# Altium schematic sheet boot.SCHDOC: Soma Backplane Front Panel PCB
size B; Engineer: Eric Jonas (jonas@soma.mit.edu); Organization: Wilson Lab; Address1: Picower Institute, MIT; Address2: 43 Vassar St. 46-5227; Address3: Cambridge, MA 02139; Address4: Australia 2086
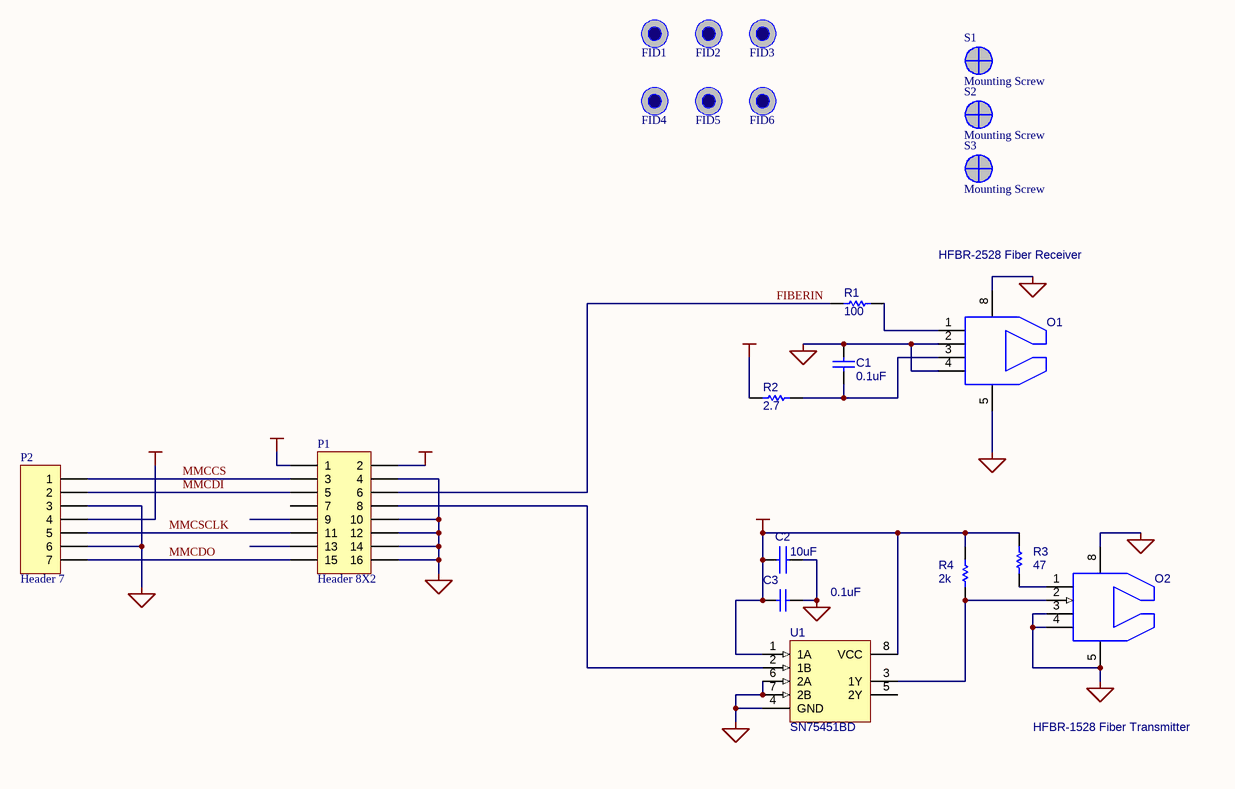
[diagram p0: boot.SCHDOC]

## Parts
C1  value 0.1uF  [CC1608-0603]  (hidden comment: Cap)
C2  value 10uF  [0603]  (hidden comment: CAPACITOR)
C3  value 0.1uF  [CC1608-0603]  (hidden comment: Cap)
FID1  FIDUCIAL  [FIDUCIAL]  (value not drawn)
FID2  FIDUCIAL  [FIDUCIAL]  (value not drawn)
FID3  FIDUCIAL  [FIDUCIAL]  (value not drawn)
FID4  FIDUCIAL  [FIDUCIAL]  (value not drawn)
FID5  FIDUCIAL  [FIDUCIAL]  (value not drawn)
FID6  FIDUCIAL  [FIDUCIAL]  (value not drawn)
O1  HFBR-2528 Fiber Receiver  [HPVL]
O2  HFBR-1528 Fiber Transmitter  [HPVL]
P1  Header 8X2  [MOLEX 15-91-2160]
P2  Header 7  [SCDA1A1501]
R1  value 100  [CR1608-0603]  (hidden comment: Res1)
R2  value 2.7  [CR1608-0603]  (hidden comment: Res1)
R3  value 47  [CR1608-0603]  (hidden comment: Res1)
R4  value 2k  [CR1608-0603]  (hidden comment: Res1)
S1  Mounting Screw  [SCREW6-32]
S2  Mounting Screw  [SCREW6-32]
S3  Mounting Screw  [SCREW6-32]
U1  SN75451BD  [SO-G8/E2.5]

## Nets
+5VCC: C2.1 C3.1 P1.2 R2.1 R3.2 R4.2 U1.1(1A) U1.8(VCC)
GND: C1.2 C2.2 C3.2 O1.2 O1.4 O1.5 O1.8 O2.3 O2.4 O2.5 O2.8 P1.4 P1.10 P1.12 P1.14 P1.16 P2.3 P2.6 U1.4(GND) U1.6(2A) U1.7(2B)
VCC: P1.1 P2.4
FIBERIN: P1.6 R1.1
MMCCS: P1.3 P2.1
MMCDI: P1.5 P2.2
MMCDO: P1.15 P2.7
MMCSCLK: P1.11 P2.5
NetC1_1: C1.1 O1.3 R2.2
NetO1_1: O1.1 R1.2
NetO2_1: O2.1 R3.1
NetO2_2: O2.2 R4.1 U1.3(1Y)
NetP1_8: P1.8 U1.2(1B)

Not connected (* = marked no-connect by the designer): P1 7 9 13; U1 5(2Y)

## Notes on the sheet
- Title:
- Engineer:
- Date:
- Revision:
- Sheet
- of
- File:

## Library data of the parts
C1 C3 = Cap: Capacitor; Manufacturer: Generic Components; Class I: Passive; Published: 8-Jun-2000; Revision: July-2002: Re-released for DXP Platform.; Publisher: Altium Limited; Class II: Capacitor
C2 = CAPACITOR: Standard Capacitor
O1 = HFBR-2528: Low-cost fiber receiver; Vendor: Agilent
O2 = HFBR-1528: Low-cost fiber transmitter; Vendor: Agilent
P1 = Header 8X2: Header, 8-Pin, Dual row; LatestRevisionDate: 17-Jul-2002; LatestRevisionNote: Re-released for DXP Platform.; Publisher: Altium Limited
P2 = Header 7: Header, 7-Pin; LatestRevisionDate: 17-Jul-2002; LatestRevisionNote: Re-released for DXP Platform.; Publisher: Altium Limited
R1-R4 = Res1: Resistor; Manufacturer: Generic Components; Class I: Passive; Published: 8-Jun-2000; Revision: July-2002: Re-released for DXP Platform.; Publisher: Altium Limited; Class II: Resistor
S1-S3 = MNTSCREW
U1 = SN75451BD: Dual Peripheral Driver; Manufacturer: Texas Instruments; Package Information: Latest Revision: Jan-1998; Class I: Interface; Published: 15-May-2002; Datasheet: 1991 Interface Circuits Data Book (May-1990); Package Reference: D008; Publisher: Altium Limited; Class II: Peripheral Driver